# Altium project dong _o_done.PrjPcb
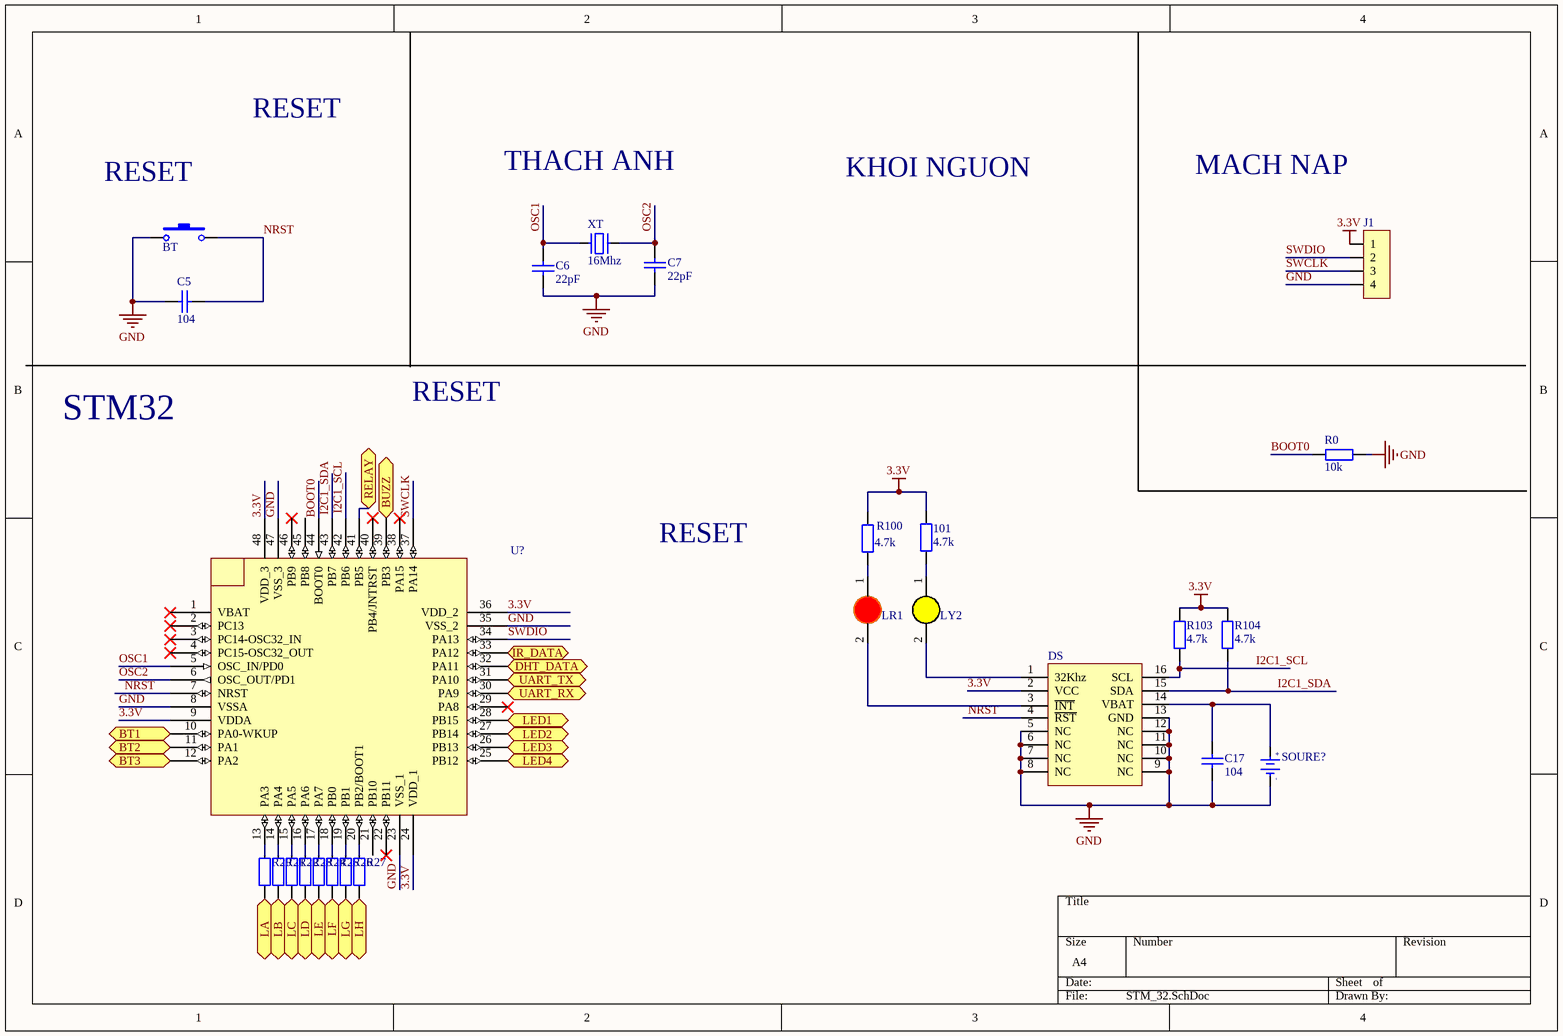
[diagram p0: STM_32.SchDoc]
9 sheets, 68 parts. Net scope: flat (ports and power ports of the same name join across sheets).
Board file: PCB2.PcbDoc
Sheets:
  STM_32.SchDoc
  KHOI_HA_APP.SchDoc
  LED_7SEG.SchDoc
  ESP8266.SchDoc
  BUTTON.SchDoc
  RELAY.SchDoc
  IR18T38.SchDoc
  DHT11.SchDoc
  BUZZER.SchDoc

## Sheet STM_32.SchDoc
size A4; SheetNumber: 1; SheetTotal: 9

### Parts
101  4.7k  [tro smd 0603]
BT  Nut Nhan 2 Chan SMD 3x6x2.5  [Nut Nhan 2 Chan SMD 3x6x2.5]  (value not drawn)
C5  104  [tu 0603]
C6  22pF  [tu 0603]
C7  22pF  [tu 0603]
C17  104  [tu 0603]
DS  DS3231 SMD  [SOIC 16]  (value not drawn)
J1  JP 1x4 2.54  [JP 1x4 CT]  (value not drawn)
LR1  LED 0805  [LED-0805-Red]  (value not drawn)
LY2  LED 0805  [LED-0805-Yellow]  (value not drawn)
R0  10k  [tro smd 0603]
R20  10k  [tro smd 0603]  (value not drawn)
R21  10k  [tro smd 0603]  (value not drawn)
R22  10k  [tro smd 0603]  (value not drawn)
R23  10k  [tro smd 0603]  (value not drawn)
R24  10k  [tro smd 0603]  (value not drawn)
R25  10k  [tro smd 0603]  (value not drawn)
R26  10k  [tro smd 0603]  (value not drawn)
R27  10k  [tro smd 0603]  (value not drawn)
R100  4.7k  [tro smd 0603]
R103  4.7k  [tro smd 0603]
R104  4.7k  [tro smd 0603]
SOURE?  CR1220 SMD  [DE PIN CR1220]  (value not drawn)
U?  STM32F103xx_LQFP48  [STM32_LQPF48]  (value not drawn)
XT  16Mhz  [Thach Anh 2 chan SMD]

### Ports
BT1 (bidir), BT2 (bidir), BT3 (bidir), BUZZ (bidir), DHT_DATA (bidir), IR_DATA (bidir), LA (bidir), LB (bidir), LC (bidir), LD (bidir), LE (bidir), LED1 (bidir), LED2 (bidir), LED3 (bidir), LED4 (bidir), LF (bidir), LG (bidir), LH (bidir), RELAY (bidir), UART_RX (bidir), UART_TX (bidir)

### Nets
3.3V: 101.2 DS.2(VCC) J1.1 R100.2 R103.2 R104.2 U?.9(VDDA) U?.24(VDD_1) U?.36(VDD_2) U?.48(VDD_3)
GND: BT.1 C5.2 C6.2 C7.2 C17.2 DS.5(NC) DS.6(NC) DS.7(NC) DS.8(NC) DS.9(NC) DS.10(NC) DS.11(NC) DS.12(NC) DS.13(GND) J1.4 R0.2 SOURE?.2(GND) U?.8(VSSA) U?.23(VSS_1) U?.35(VSS_2) U?.47(VSS_3)
BOOT0: R0.1 U?.44(BOOT0)
I2C1_SCL: DS.16(SCL) R103.1 U?.42(PB6)
I2C1_SDA: DS.15(SDA) R104.1 U?.43(PB7)
NRST: BT.2 C5.1 DS.4(~{RST}) U?.7(NRST)
OSC1: C6.1 U?.5(OSC_IN/PD0) XT.1
OSC2: C7.1 U?.6(OSC_OUT/PD1) XT.2
SWCLK: J1.3 U?.37(PA14)
SWDIO: J1.2 U?.34(PA13)
Net101_1: 101.1 LY2.1(A)
NetBT1_1: U?.10(PA0-WKUP) ; port BT1
NetBT2_1: U?.11(PA1) ; port BT2
NetBT3_1: U?.12(PA2) ; port BT3
NetC17_1: C17.1 DS.14(VBAT) SOURE?.1(+3V)
NetDHT11_2: U?.32(PA11) ; port DHT_DATA
NetDS_1: DS.1(32Khz) LY2.2(K)
NetDS_3: DS.3(~{INT}) LR1.2(K)
NetESP8266_1: U?.31(PA10) ; port UART_TX
NetESP8266_8: U?.30(PA9) ; port UART_RX
NetIR18T38_2: U?.33(PA12) ; port IR_DATA
NetLED1_2: R24.2 ; port LE
NetLED1_3: R23.2 ; port LD
NetLED1_4: R22.2 ; port LC
NetLED1_6: R21.2 ; port LB
NetLED1_7: R20.2 ; port LA
NetLED1_8: R27.2 ; port LH
NetLED1_9: R25.2 ; port LF
NetLED1_10: R26.2 ; port LG
NetLR1_1: LR1.1(A) R100.1
NetR5_1: U?.28(PB15) ; port LED1
NetR6_1: U?.27(PB14) ; port LED2
NetR7_1: U?.26(PB13) ; port LED3
NetR8_1: U?.25(PB12) ; port LED4
NetR11_1: U?.41(PB5) ; port RELAY
NetR14_1: U?.39(PB3) ; port BUZZ
NetR20_1: R20.1 U?.13(PA3)
NetR21_1: R21.1 U?.14(PA4)
NetR22_1: R22.1 U?.15(PA5)
NetR23_1: R23.1 U?.16(PA6)
NetR24_1: R24.1 U?.17(PA7)
NetR25_1: R25.1 U?.18(PB0)
NetR26_1: R26.1 U?.19(PB1)
NetR27_1: R27.1 U?.20(PB2/BOOT1)

Not connected (* = marked no-connect by the designer): U? 1(VBAT)* 2(PC13)* 3(PC14-OSC32_IN)* 4(PC15-OSC32_OUT)* 21(PB10) 22(PB11)* 29(PA8)* 38(PA15)* 40(PB4/JNTRST)* 45(PB8) 46(PB9)*

### Notes on the sheet
- RESET
- THACH ANH
- KHOI NGUON
- MACH NAP
- (near BT) RESET
- STM32
- (in symbol De pin CR1220 SMD) +; -

### Library data of the parts
101 R100 R103 R104 = Tro 0603 5% 4.7k: Dán; Don_Vi: Con; So_Chan: 2; Ten_Linh_Kien: Trở 0603 5% 4.7k; Ma_Hang: MH006327; Chung_Loai: Dán; Kieu_Chan: *
BT = Nut Nhan 2 Chan SMD 3x6x2.5: Ma_Hang: MH001036; Ten: Nút Nhấn 2 Chân 3x6x2.5MM SMD
C5 C17 = Tu 0603 104 50V 10%: Dán; Don_Vi: Con; So_Chan: 2; Ten_Linh_Kien: Tụ 0603 104-100nF 10% 50V; Ma_Hang: MH004568; Chung_Loai: Dán; Kieu_Chan: *
C6 C7 = Tu 0603 22pF 50V 10%: Dán; Don_Vi: Con; So_Chan: 2; Ten_Linh_Kien: Tụ 0603 22pF 50V 10%; Ma_Hang: MH004570; Chung_Loai: Dán; Kieu_Chan: *
DS = DS3231 SMD: SOIC
J1 = JP 1x4 2.54 Cai Thang: Cắm; Ten_Linh_Kien: Jump Đơn Cái 2.54MM 1x20P Thẳng; Don_Vi: Con; Ma_Hang: MH004006; Ghi_Chu: *; Kieu_Chan: *; Chung_Loai: Cắm
LR1 = LED 0805 Do: Dán; Don_Vi: Con; Ma_Hang: MH000897; Ten_Linh_Kien: LED 0805 Màu Đỏ (Red); Ghi_Chu: *; Kieu_Chan: *; Chung_Loai: Dán
LY2 = LED 0805 Vang: Dán; Don_Vi: Con; Ma_Hang: MH002329; Ten_Linh_Kien: LED 0805 Màu Vàng ( Yellow); Ghi_Chu: *; Kieu_Chan: *; Chung_Loai: Dán
R0 R20-R27 = Tro 0603 1% 10k: Dán; Don_Vi: Con; So_Chan: 2; Ten_Linh_Kien: Trở 0603 1% 10k; Ma_Hang: MH006333; Chung_Loai: Dán; Kieu_Chan: *
SOURE? = De pin CR1220 SMD: Ten: Đế PIN CR1220 SMD; Ma_Hang: MH000833
XT = Thach Anh 2 chan SMD: Crystal For all Crystal 2pin.; Value: 4Mhz
U? = STM32F103xx_LQFP48: Published: 30-May-2008; DatasheetVersion: rev6, Mar-2008; PackageVersion: Mar-2008; PackageReference: LQFP48; Publisher: Altium Limited; PackageDescription: 48-Pin Low-Profile Quad Flat Pack, 7 x 7 mm Body, 0.5 mm Pitch (LQFP48); ComponentLink1Description: Manufacturer Link; ComponentLink1URL: www.st.com/stm32; ComponentLink2Description: Datasheet; ComponentLink2URL: http://www.st.com/stonline/products/literature/ds/13587.pdf

## Sheet KHOI_HA_APP.SchDoc
size A; SheetNumber: 2; SheetTotal: 9
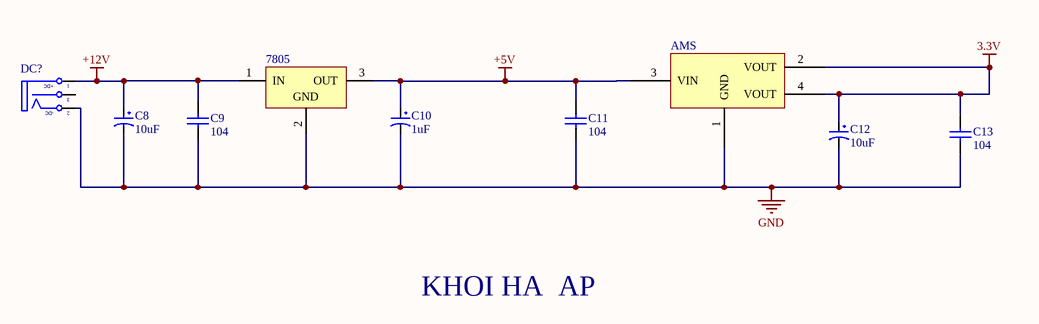
[diagram p1: KHOI_HA_APP.SchDoc]

### Parts
7805  78M05 SMD TO252  [TO252]  (value not drawn)
AMS  AMS1117-3.3V  [SOT223]  (value not drawn)
C8  10uF  [tu tantalum smd3216]
C9  104  [tu 0603]
C10  1uF  [tu tantalum smd3216]
C11  104  [tu 0603]
C12  10uF  [tu tantalum smd3216]
C13  104  [tu 0603]
DC?  JACK DC 5.5  [JACK DC 5.5]  (value not drawn)

### Nets
3.3V: AMS.2(VOUT) AMS.4(VOUT) C12.1 C13.1
+5V: 7805.3(OUT) AMS.3(VIN) C10.1 C11.1
+12V: 7805.1(IN) C8.1 C9.1 DC?.1(T)
GND: 7805.2(GND) AMS.1(GND) C8.2 C9.2 C10.2 C11.2 C12.2 C13.2 DC?.2(TN)

Not connected (* = marked no-connect by the designer): DC? 3(S)

### Notes on the sheet
- KHOI HA  AP
- (in symbol JACK DC 5.5) +DC; -DC

### Library data of the parts
7805 = 78M05 SMD TO252: Dán; Don_Vi: Con; Ten_Linh_Kien: 78M05 TO252; Ma_Hang: MH001917; Ghi_Chu: *; Kieu_Chan: *; Chung_Loai: Dán
AMS = AMS1117 SMD: Dán; Value: AMS1117-3.3V SOT223; Don_Vi: Con; Ma_Hang: MH000596; Ghi_Chu: *; Kieu_Chan: *; Chung_Loai: Dán
C8 C12 = Tu tantalum 10uF 16V SMD3216: Dán; Don_Vi: Con; So_Chan: 2; Ten_Linh_Kien: Tụ tantalum 106C-10uF 16V SMD3216; Ma_Hang: MH001954; Chung_Loai: Dán; Kieu_Chan: *
C9 C11 C13 = Tu 0603 104 50V 10%: as C5 on sheet STM_32; Chung_Loai: Dán; Kieu_Chan: *
C10 = Tu tantalum 1uF 25V SMD3216: Dán; Don_Vi: Con; So_Chan: 2; Ten_Linh_Kien: Tụ tantalum 105E-1uF 25V SMD3216; Ma_Hang: MH007472; Chung_Loai: Dán; Kieu_Chan: *
DC? = JACK DC 5.5: Value: Jac DC

## Sheet LED_7SEG.SchDoc
size A; SheetNumber: 3; SheetTotal: 9
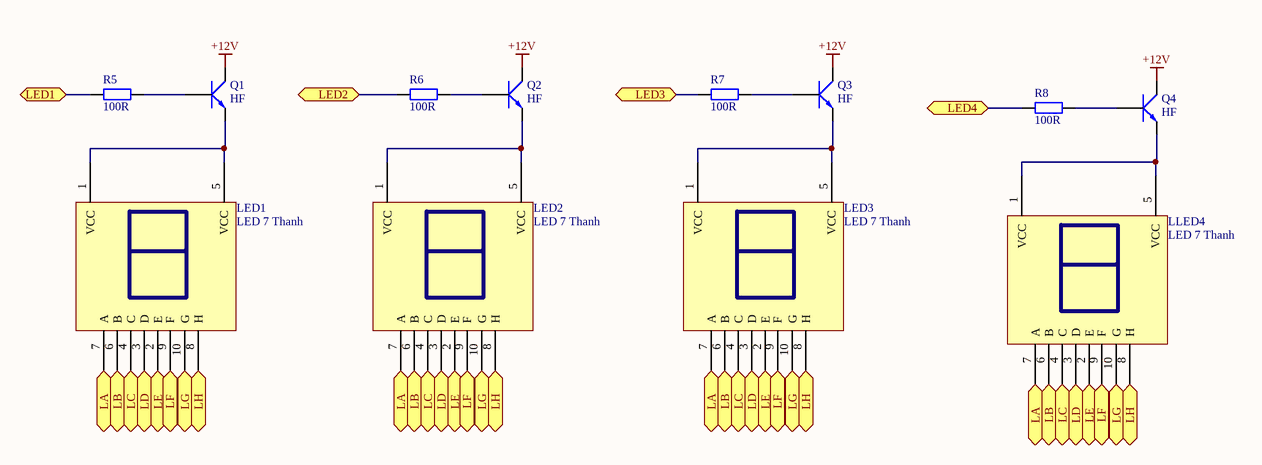
[diagram p2: LED_7SEG.SchDoc]

### Parts
LED1  LED 7 Thanh  [LED7SEG_2.3inch]
LED2  LED 7 Thanh  [LED7SEG_2.3inch]
LED3  LED 7 Thanh  [LED7SEG_2.3inch]
LLED4  LED 7 Thanh  [LED7SEG_2.3inch]
Q1  HF  [SOT23]
Q2  HF  [SOT23]
Q3  HF  [SOT23]
Q4  HF  [SOT23]
R5  100R  [tro smd 0603]
R6  100R  [tro smd 0603]
R7  100R  [tro smd 0603]
R8  100R  [tro smd 0603]

### Ports
LA (bidir), LB (bidir), LC (bidir), LD (bidir), LE (bidir), LED1 (bidir), LED2 (bidir), LED3 (bidir), LED4 (bidir), LF (bidir), LG (bidir), LH (bidir)

### Nets
+12V: Q1.3(C) Q2.3(C) Q3.3(C) Q4.3(C)
NetLED1_1: LED1.1(VCC) LED1.5(VCC) Q1.2(E)
NetLED1_2: LED1.2(E) LED2.2(E) LED3.2(E) LLED4.2(E) ; port LE
NetLED1_3: LED1.3(D) LED2.3(D) LED3.3(D) LLED4.3(D) ; port LD
NetLED1_4: LED1.4(C) LED2.4(C) LED3.4(C) LLED4.4(C) ; port LC
NetLED1_6: LED1.6(B) LED2.6(B) LED3.6(B) LLED4.6(B) ; port LB
NetLED1_7: LED1.7(A) LED2.7(A) LED3.7(A) LLED4.7(A) ; port LA
NetLED1_8: LED1.8(H) LED2.8(H) LED3.8(H) LLED4.8(H) ; port LH
NetLED1_9: LED1.9(F) LED2.9(F) LED3.9(F) LLED4.9(F) ; port LF
NetLED1_10: LED1.10(G) LED2.10(G) LED3.10(G) LLED4.10(G) ; port LG
NetLED2_1: LED2.1(VCC) LED2.5(VCC) Q2.2(E)
NetLED3_1: LED3.1(VCC) LED3.5(VCC) Q3.2(E)
NetLLED4_1: LLED4.1(VCC) LLED4.5(VCC) Q4.2(E)
NetQ1_1: Q1.1(B) R5.2
NetQ2_1: Q2.1(B) R6.2
NetQ3_1: Q3.1(B) R7.2
NetQ4_1: Q4.1(B) R8.2
NetR5_1: R5.1 ; port LED1
NetR6_1: R6.1 ; port LED2
NetR7_1: R7.1 ; port LED3
NetR8_1: R8.1 ; port LED4

### Library data of the parts
LED1-LED3 LLED4 = LED 7x1 2.3inch Anot: Dán; Don_Vi: Con; Ma_Hang: MH000901; Ten_Linh_Kien: Led 7 2.3 1 Số Anot (Sáng Đỏ); Ghi_Chu: *; Kieu_Chan: *; Chung_Loai: Dán
Q1-Q4 = C1815 HF SMD: NPN transistor; Value: C9014
R5-R8 = Tro 0603 5% 100R: Dán; Don_Vi: Con; So_Chan: 2; Ten_Linh_Kien: Trở 0603 5% 100R; Ma_Hang: MH006315; Chung_Loai: Dán; Kieu_Chan: *

## Sheet ESP8266.SchDoc
size A; SheetNumber: 4; SheetTotal: 9
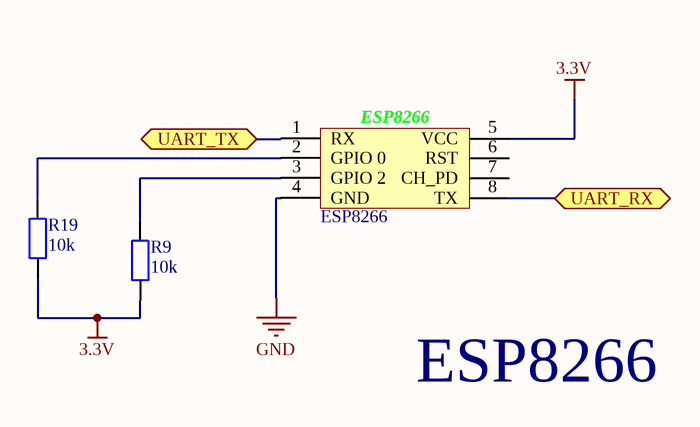
[diagram p3: ESP8266.SchDoc]

### Parts
ESP8266  ESP8266 Module  [ESP2866 Module]  (value not drawn)
R9  10k  [tro smd 0603]
R19  10k  [tro smd 0603]

### Ports
UART_RX (bidir), UART_TX (bidir)

### Nets
3.3V: ESP8266.5(VCC) R9.1 R19.1
GND: ESP8266.4(GND)
NetESP8266_1: ESP8266.1(RX) ; port UART_TX
NetESP8266_2: ESP8266.2(GPIO_0) R19.2
NetESP8266_3: ESP8266.3(GPIO_2) R9.2
NetESP8266_8: ESP8266.8(TX) ; port UART_RX

Not connected (* = marked no-connect by the designer): ESP8266 6(RST) 7(CH_PD)

### Notes on the sheet
- ESP8266

### Library data of the parts
R9 R19 = Tro 0603 5% 10k: Dán; Don_Vi: Con; So_Chan: 2; Ten_Linh_Kien: Trở 0603 5% 10k; Ma_Hang: MH006316; Chung_Loai: Dán; Kieu_Chan: *

## Sheet BUTTON.SchDoc
size A; SheetNumber: 5; SheetTotal: 9
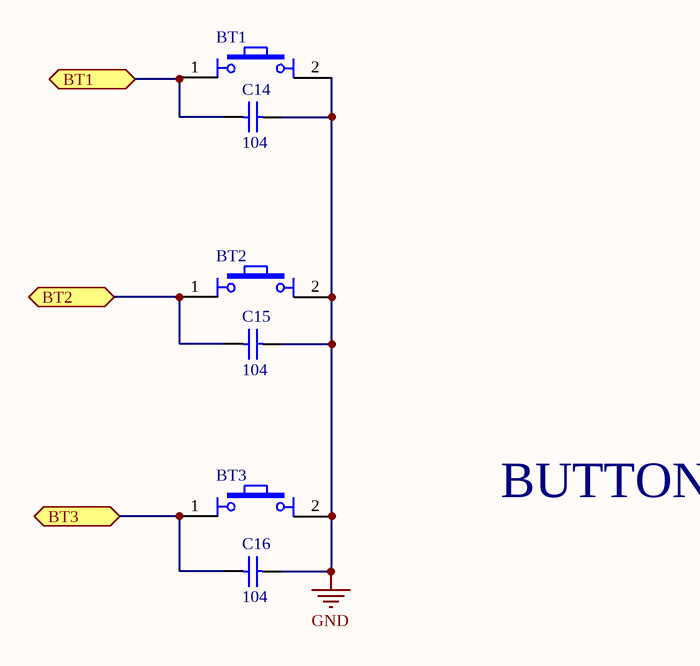
[diagram p4: BUTTON.SchDoc]

### Parts
BT1  Nut Nhan 4 Chan Cam 6x6  [Nut Nhan 4 Chan Cam 6x6]  (value not drawn)
BT2  Nut Nhan 4 Chan Cam 6x6  [Nut Nhan 4 Chan Cam 6x6]  (value not drawn)
BT3  Nut Nhan 4 Chan Cam 6x6  [Nut Nhan 4 Chan Cam 6x6]  (value not drawn)
C14  104  [tu 0603]
C15  104  [tu 0603]
C16  104  [tu 0603]

### Ports
BT1 (bidir), BT2 (bidir), BT3 (bidir)

### Nets
GND: BT1.2 BT2.2 BT3.2 C14.1 C15.1 C16.1
NetBT1_1: BT1.1 C14.2 ; port BT1
NetBT2_1: BT2.1 C15.2 ; port BT2
NetBT3_1: BT3.1 C16.2 ; port BT3

### Notes on the sheet
- BUTTON

### Library data of the parts
BT1-BT3 = Nut Nhan 4 Chan Cam 6x6: Nut Nhan 4 Chan 6x6mm; Ten: Nút Nhấn 4 Chân 6x6x5MM DIP; Ma_Hang: MH004584
C14-C16 = Tu 0603 104 50V 10%: as C5 on sheet STM_32; Chung_Loai: Dán; Kieu_Chan: *

## Sheet RELAY.SchDoc
size A; SheetNumber: 6; SheetTotal: 9
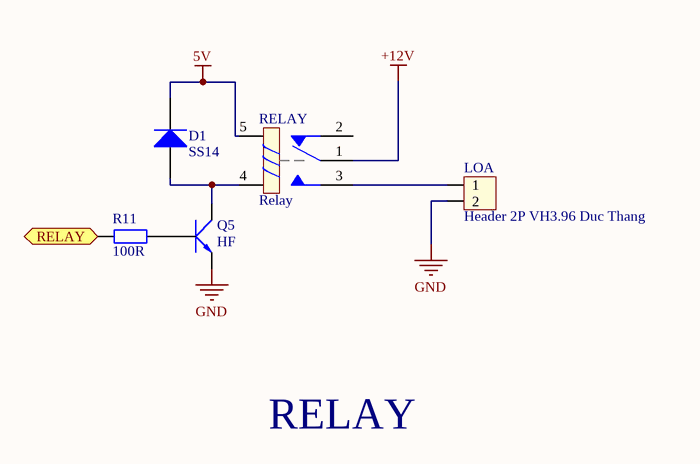
[diagram p5: RELAY.SchDoc]

### Parts
D1  SS14  [DIODE SMA]
LOA  Header 2P VH3.96 Duc Thang  [VH3.96M-2]
Q5  HF  [SOT23]
R11  100R  [tro smd 0603]
RELAY  Relay  [Relay 5 Chan SRD]

### Ports
RELAY (bidir)

### Nets
5V: D1.2(K) RELAY.5
+12V: RELAY.1
GND: LOA.2 Q5.2(E)
NetD1_1: D1.1(A) Q5.3(C) RELAY.4
NetLOA_1: LOA.1 RELAY.3
NetQ5_1: Q5.1(B) R11.2
NetR11_1: R11.1 ; port RELAY

Not connected (* = marked no-connect by the designer): RELAY 2

### Notes on the sheet
- RELAY

### Library data of the parts
D1 = Diode SS14 ( 1N5819): Dán; Ma_Hang: MH002211; Don_Vi: Con; Ten_Linh_Kien: Diode SS14 DO214 Schottky 1A 40V ( 1N5819 DO214); Chung_Loai: Dán; Ghi_Chu: *; Kieu_Chan: *
LOA = Header 2P VH3.96 Duc Thang: Cắm; Ten_Linh_Kien: Header 2P XH2.54-2P Đực Thẳng; Don_Vi: Con; Ma_Hang: MH001283; Chung_Loai: Cắm
Q5 = C1815 HF SMD: NPN transistor; Value: C9014
R11 = Tro 0603 5% 100R: as R5 on sheet LED_7SEG; Chung_Loai: Dán; Kieu_Chan: *
RELAY = Relay 5 Chan SRD: Relay 5 Chan; Ma_Hang: MH009374; Ten: Relay 5V10A SRD-05VDC-SL-C Chính Hãng

## Sheet IR18T38.SchDoc
size A; SheetNumber: 7; SheetTotal: 9
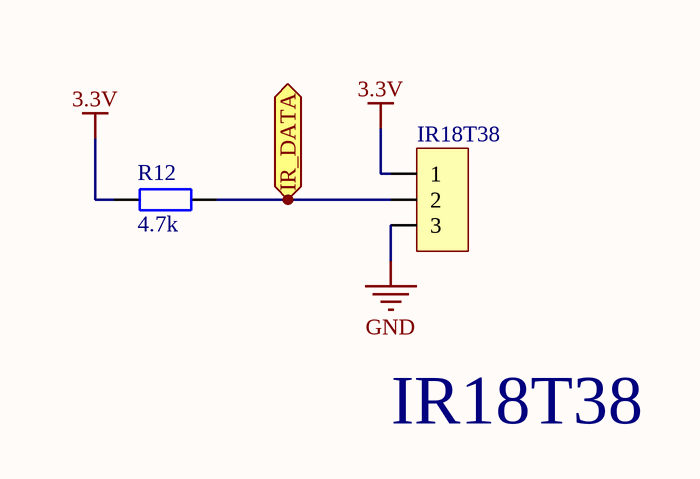
[diagram p6: IR18T38.SchDoc]

### Parts
IR18T38  JP 1x3 2.54  [JP 1x3 CT]  (value not drawn)
R12  4.7k  [tro smd 0603]

### Ports
IR_DATA (bidir)

### Nets
3.3V: IR18T38.1 R12.1
GND: IR18T38.3
NetIR18T38_2: IR18T38.2 R12.2 ; port IR_DATA

### Notes on the sheet
- IR18T38

### Library data of the parts
IR18T38 = JP 1x3 2.54 Cai Thang: Cắm; Ten_Linh_Kien: Jump Đơn Cái 2.54MM 1x20P Thẳng; Don_Vi: Con; Ma_Hang: MH004006; Ghi_Chu: *; Kieu_Chan: *; Chung_Loai: Cắm
R12 = Tro 0603 5% 4.7k: as 101 on sheet STM_32; Chung_Loai: Dán; Kieu_Chan: *

## Sheet DHT11.SchDoc
size A; SheetNumber: 8; SheetTotal: 9
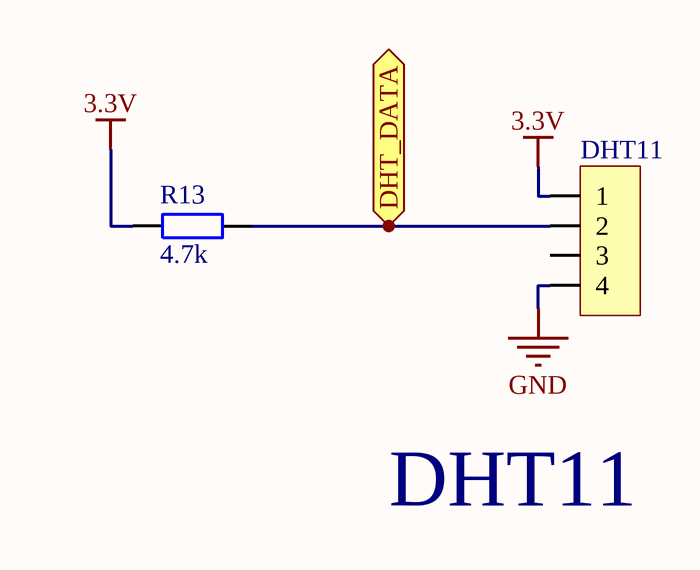
[diagram p7: DHT11.SchDoc]

### Parts
DHT11  JP 1x4 2.54  [JP 1x4 CT]  (value not drawn)
R13  4.7k  [tro smd 0603]

### Ports
DHT_DATA (bidir)

### Nets
3.3V: DHT11.1 R13.1
GND: DHT11.4
NetDHT11_2: DHT11.2 R13.2 ; port DHT_DATA

Not connected (* = marked no-connect by the designer): DHT11 3

### Notes on the sheet
- DHT11

### Library data of the parts
DHT11 = JP 1x4 2.54 Cai Thang: as J1 on sheet STM_32; Ghi_Chu: *; Kieu_Chan: *; Chung_Loai: Cắm
R13 = Tro 0603 5% 4.7k: as 101 on sheet STM_32; Chung_Loai: Dán; Kieu_Chan: *

## Sheet BUZZER.SchDoc
size A; SheetNumber: 9; SheetTotal: 9
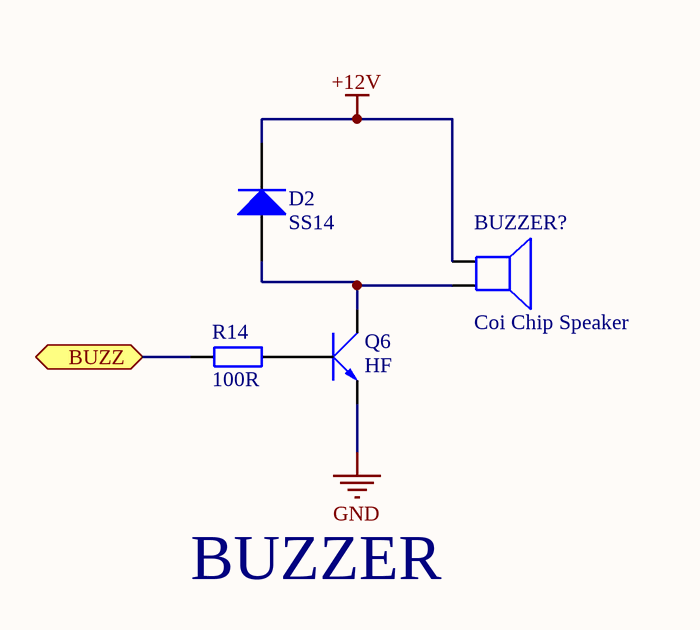
[diagram p8: BUZZER.SchDoc]

### Parts
BUZZER?  Coi Chip Speaker  [Coi Chip Speacker]
D2  SS14  [DIODE SMA]
Q6  HF  [SOT23]
R14  100R  [tro smd 0603]

### Ports
BUZZ (bidir)

### Nets
+12V: BUZZER?.1 D2.2(K)
GND: Q6.2(E)
NetBUZZER?_2: BUZZER?.2 D2.1(A) Q6.3(C)
NetQ6_1: Q6.1(B) R14.2
NetR14_1: R14.1 ; port BUZZ

### Notes on the sheet
- BUZZER

### Library data of the parts
BUZZER? = Coi Chip Speaker: Còi chip
D2 = Diode SS14 ( 1N5819): as D1 on sheet RELAY; Chung_Loai: Dán; Ghi_Chu: *; Kieu_Chan: *
Q6 = C1815 HF SMD: NPN transistor; Value: C9014
R14 = Tro 0603 5% 100R: as R5 on sheet LED_7SEG; Chung_Loai: Dán; Kieu_Chan: *

## Nets that join several sheets
3.3V: STM_32 (10 pins), KHOI_HA_APP (AMS.2 AMS.4 C12.1 C13.1), ESP8266 (ESP8266.5 R9.1 R19.1), IR18T38 (IR18T38.1 R12.1), DHT11 (DHT11.1 R13.1)
+12V: KHOI_HA_APP (7805.1 C8.1 C9.1 DC?.1), LED_7SEG (Q1.3 Q2.3 Q3.3 Q4.3), RELAY (RELAY.1), BUZZER (BUZZER?.1 D2.2)
GND: STM_32 (21 pins), KHOI_HA_APP (9 pins), ESP8266 (ESP8266.4), BUTTON (6 pins), RELAY (LOA.2 Q5.2), IR18T38 (IR18T38.3), DHT11 (DHT11.4), BUZZER (Q6.2)
NetBT1_1: STM_32 (U?.10), BUTTON (BT1.1 C14.2)
NetBT2_1: STM_32 (U?.11), BUTTON (BT2.1 C15.2)
NetBT3_1: STM_32 (U?.12), BUTTON (BT3.1 C16.2)
NetDHT11_2: STM_32 (U?.32), DHT11 (DHT11.2 R13.2)
NetESP8266_1: STM_32 (U?.31), ESP8266 (ESP8266.1)
NetESP8266_8: STM_32 (U?.30), ESP8266 (ESP8266.8)
NetIR18T38_2: STM_32 (U?.33), IR18T38 (IR18T38.2 R12.2)
NetLED1_2: STM_32 (R24.2), LED_7SEG (LED1.2 LED2.2 LED3.2 LLED4.2)
NetLED1_3: STM_32 (R23.2), LED_7SEG (LED1.3 LED2.3 LED3.3 LLED4.3)
NetLED1_4: STM_32 (R22.2), LED_7SEG (LED1.4 LED2.4 LED3.4 LLED4.4)
NetLED1_6: STM_32 (R21.2), LED_7SEG (LED1.6 LED2.6 LED3.6 LLED4.6)
NetLED1_7: STM_32 (R20.2), LED_7SEG (LED1.7 LED2.7 LED3.7 LLED4.7)
NetLED1_8: STM_32 (R27.2), LED_7SEG (LED1.8 LED2.8 LED3.8 LLED4.8)
NetLED1_9: STM_32 (R25.2), LED_7SEG (LED1.9 LED2.9 LED3.9 LLED4.9)
NetLED1_10: STM_32 (R26.2), LED_7SEG (LED1.10 LED2.10 LED3.10 LLED4.10)
NetR5_1: STM_32 (U?.28), LED_7SEG (R5.1)
NetR6_1: STM_32 (U?.27), LED_7SEG (R6.1)
NetR7_1: STM_32 (U?.26), LED_7SEG (R7.1)
NetR8_1: STM_32 (U?.25), LED_7SEG (R8.1)
NetR11_1: STM_32 (U?.41), RELAY (R11.1)
NetR14_1: STM_32 (U?.39), BUZZER (R14.1)